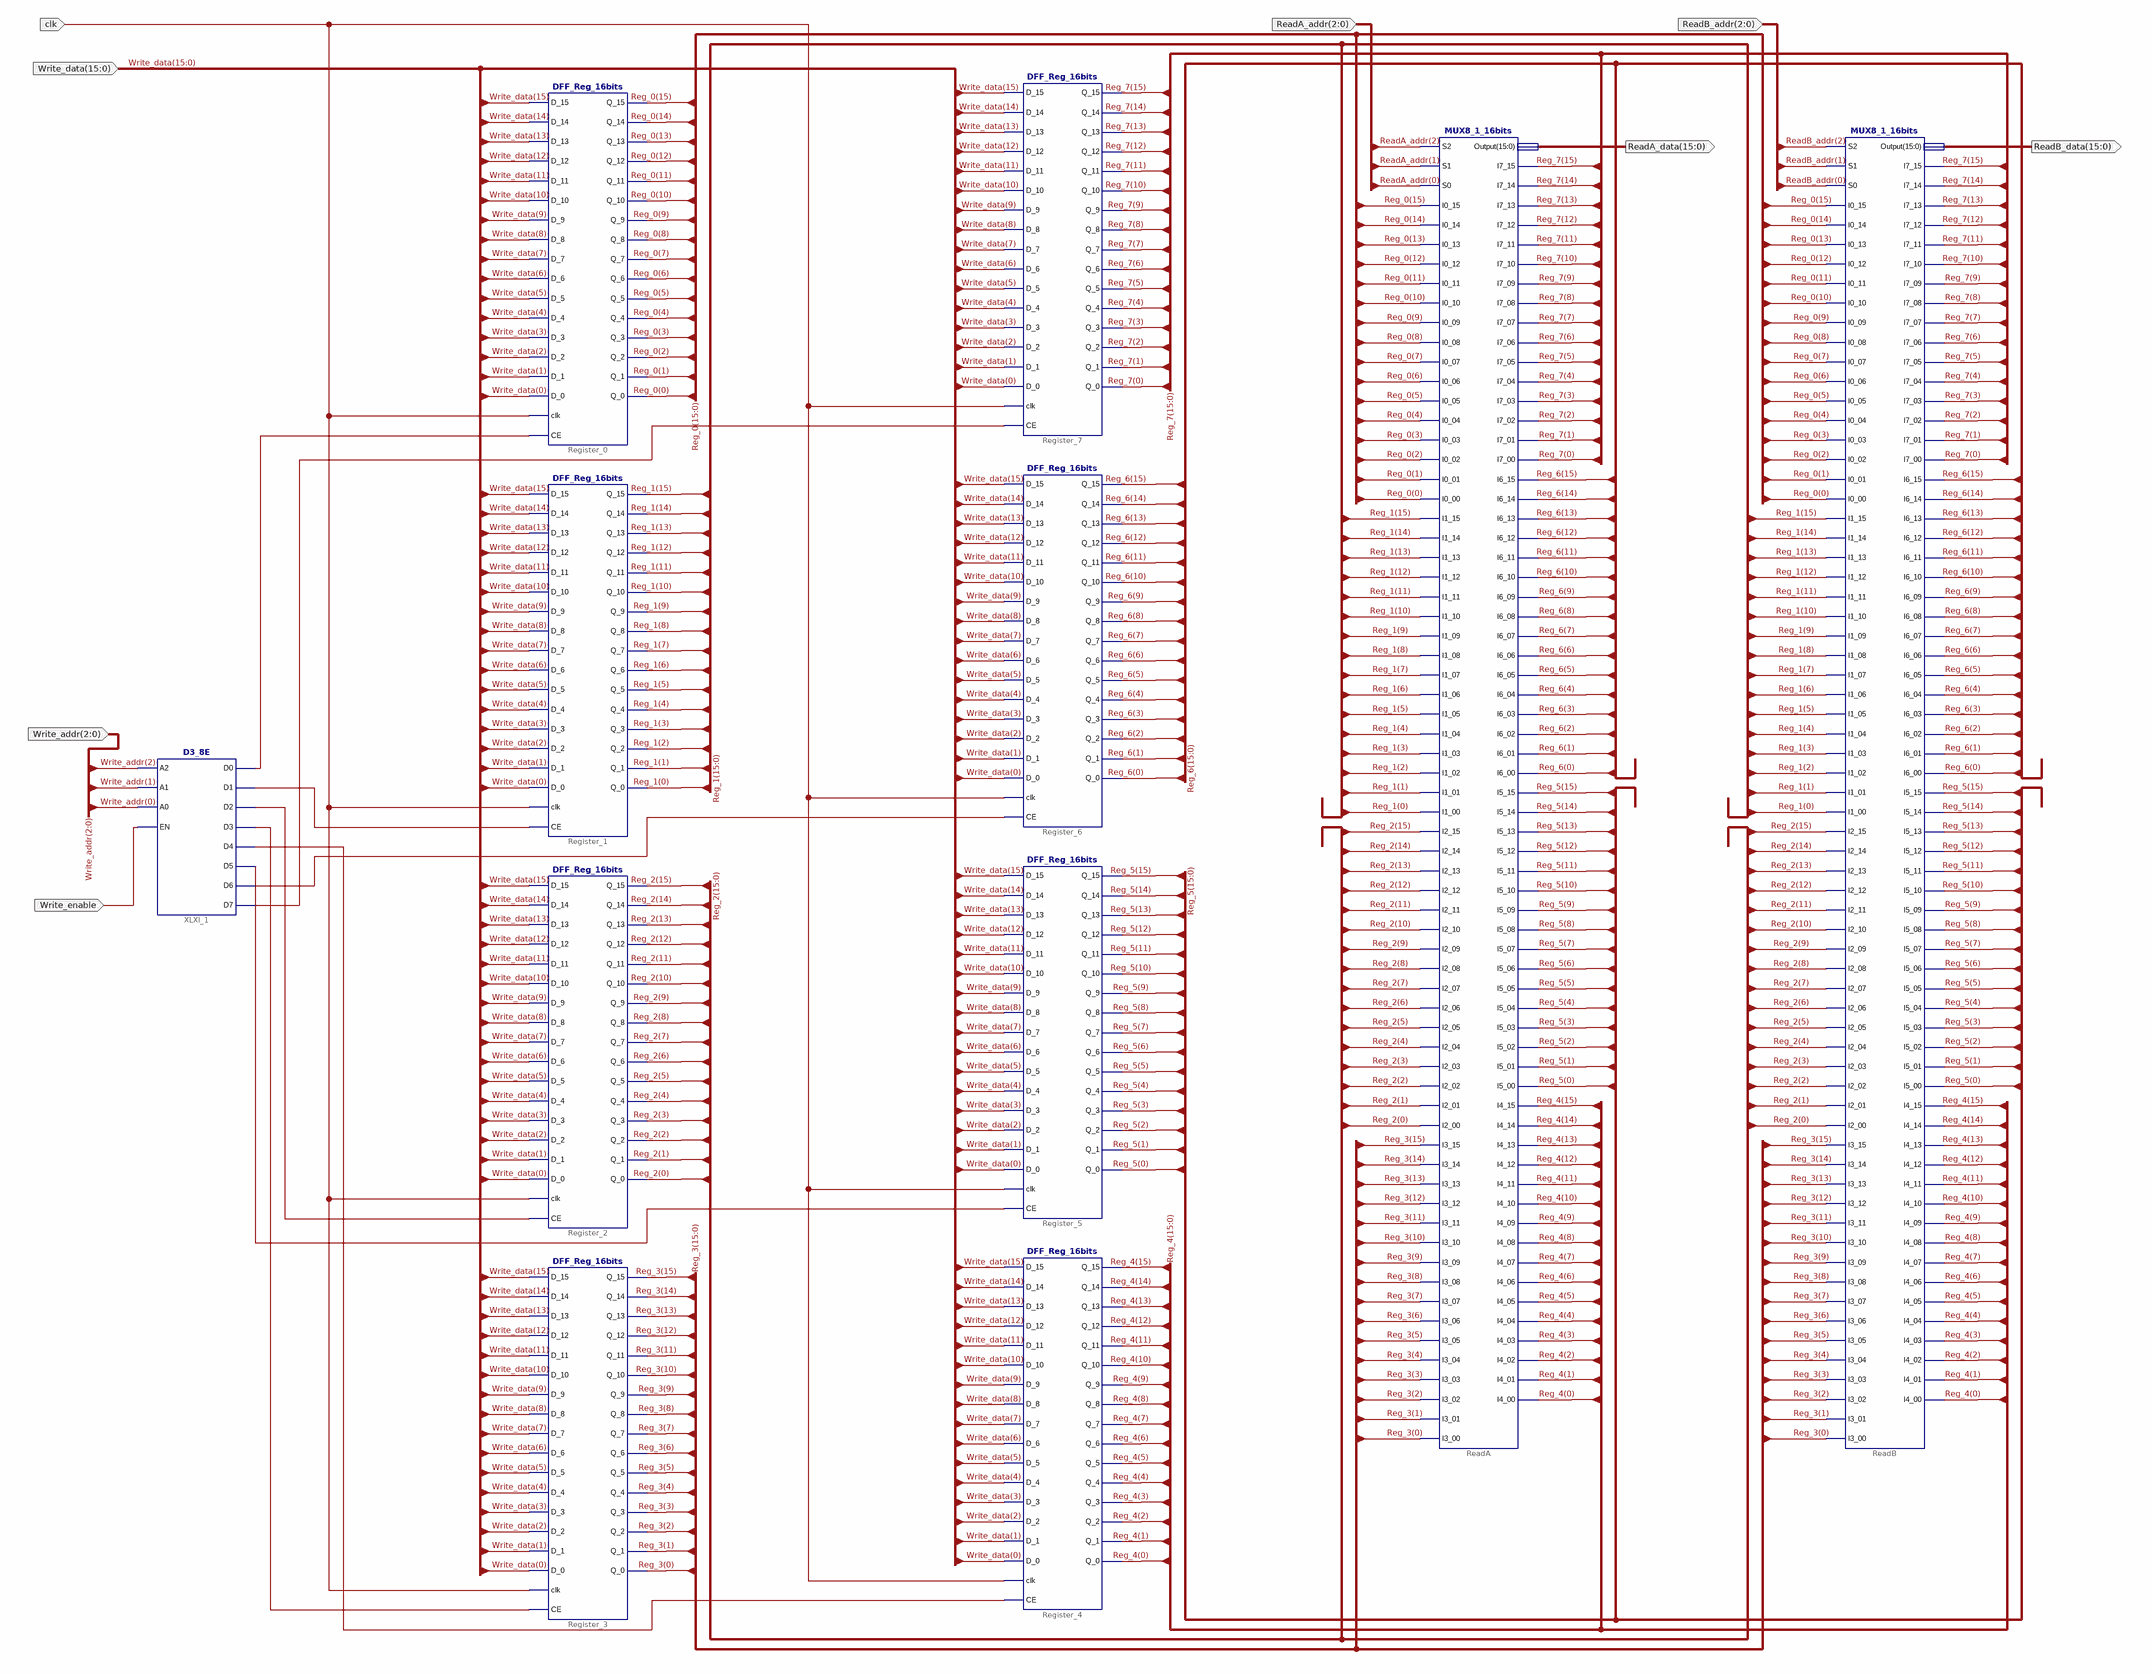
[diagram p0: schematic sheet 1]
// Xilinx ISE schematic Eight_Reg_16bits.sch (virtex6) as structural Verilog: 11 symbols, 8 ports
module Eight_Reg_16bits (
  input  [2:0] Write_addr,
  input  Write_enable,
  input  clk,
  input  [15:0] Write_data,
  input  [2:0] ReadA_addr,
  input  [2:0] ReadB_addr,
  output [15:0] ReadA_data,
  output [15:0] ReadB_data
);

  wire XLXN_65, XLXN_66, XLXN_67, XLXN_68, XLXN_756, XLXN_757, XLXN_758, XLXN_759;
  wire [15:0] Reg_0, Reg_1, Reg_2, Reg_3, Reg_4, Reg_5, Reg_6, Reg_7;

  MUX8_1_16bits ReadB (
    .I4_00(Reg_4[0]), .I4_01(Reg_4[1]), .I4_02(Reg_4[2]), .I4_03(Reg_4[3]), .I4_04(Reg_4[4]),
    .I4_05(Reg_4[5]), .I4_06(Reg_4[6]), .I4_07(Reg_4[7]), .I4_08(Reg_4[8]), .I4_09(Reg_4[9]),
    .I4_10(Reg_4[10]), .I4_11(Reg_4[11]), .I4_12(Reg_4[12]), .I4_13(Reg_4[13]), .I4_14(Reg_4[14]),
    .I4_15(Reg_4[15]), .I5_00(Reg_5[0]), .I5_01(Reg_5[1]), .I5_02(Reg_5[2]), .I5_03(Reg_5[3]),
    .I5_04(Reg_5[4]), .I5_05(Reg_5[5]), .I5_06(Reg_5[6]), .I5_07(Reg_5[7]), .I5_08(Reg_5[8]),
    .I5_09(Reg_5[9]), .I5_10(Reg_5[10]), .I5_11(Reg_5[11]), .I5_12(Reg_5[12]), .I5_13(Reg_5[13]),
    .I5_14(Reg_5[14]), .I5_15(Reg_5[15]), .I6_00(Reg_6[0]), .I6_01(Reg_6[1]), .I6_02(Reg_6[2]),
    .I6_03(Reg_6[3]), .I6_04(Reg_6[4]), .I6_05(Reg_6[5]), .I6_06(Reg_6[6]), .I6_07(Reg_6[7]),
    .I6_08(Reg_6[8]), .I6_09(Reg_6[9]), .I6_10(Reg_6[10]), .I6_11(Reg_6[11]), .I6_12(Reg_6[12]),
    .I6_13(Reg_6[13]), .I6_14(Reg_6[14]), .I6_15(Reg_6[15]), .I7_00(Reg_7[0]), .I7_01(Reg_7[1]),
    .I7_02(Reg_7[2]), .I7_03(Reg_7[3]), .I7_04(Reg_7[4]), .I7_05(Reg_7[5]), .I7_06(Reg_7[6]),
    .I7_07(Reg_7[7]), .I7_08(Reg_7[8]), .I7_09(Reg_7[9]), .I7_10(Reg_7[10]), .I7_11(Reg_7[11]),
    .I7_12(Reg_7[12]), .I7_13(Reg_7[13]), .I7_14(Reg_7[14]), .I7_15(Reg_7[15]), .Output(ReadB_data),
    .S2(ReadB_addr[2]), .S1(ReadB_addr[1]), .S0(ReadB_addr[0]), .I3_15(Reg_3[15]), .I3_14(Reg_3[14]),
    .I3_13(Reg_3[13]), .I3_12(Reg_3[12]), .I3_11(Reg_3[11]), .I3_10(Reg_3[10]), .I3_09(Reg_3[9]),
    .I3_08(Reg_3[8]), .I3_07(Reg_3[7]), .I3_06(Reg_3[6]), .I3_05(Reg_3[5]), .I3_04(Reg_3[4]),
    .I3_03(Reg_3[3]), .I3_02(Reg_3[2]), .I3_01(Reg_3[1]), .I3_00(Reg_3[0]), .I2_15(Reg_2[15]),
    .I2_14(Reg_2[14]), .I2_13(Reg_2[13]), .I2_12(Reg_2[12]), .I2_11(Reg_2[11]), .I2_10(Reg_2[10]),
    .I2_09(Reg_2[9]), .I2_08(Reg_2[8]), .I2_07(Reg_2[7]), .I2_06(Reg_2[6]), .I2_05(Reg_2[5]),
    .I2_04(Reg_2[4]), .I2_03(Reg_2[3]), .I2_02(Reg_2[2]), .I2_01(Reg_2[1]), .I2_00(Reg_2[0]),
    .I1_15(Reg_1[15]), .I1_14(Reg_1[14]), .I1_13(Reg_1[13]), .I1_12(Reg_1[12]), .I1_11(Reg_1[11]),
    .I1_10(Reg_1[10]), .I1_09(Reg_1[9]), .I1_08(Reg_1[8]), .I1_07(Reg_1[7]), .I1_06(Reg_1[6]),
    .I1_05(Reg_1[5]), .I1_04(Reg_1[4]), .I1_03(Reg_1[3]), .I1_02(Reg_1[2]), .I1_01(Reg_1[1]),
    .I1_00(Reg_1[0]), .I0_15(Reg_0[15]), .I0_14(Reg_0[14]), .I0_13(Reg_0[13]), .I0_12(Reg_0[12]),
    .I0_11(Reg_0[11]), .I0_10(Reg_0[10]), .I0_09(Reg_0[9]), .I0_08(Reg_0[8]), .I0_07(Reg_0[7]),
    .I0_06(Reg_0[6]), .I0_05(Reg_0[5]), .I0_04(Reg_0[4]), .I0_03(Reg_0[3]), .I0_02(Reg_0[2]),
    .I0_01(Reg_0[1]), .I0_00(Reg_0[0]));
  DFF_Reg_16bits Register_0 (
    .CE(XLXN_65), .clk(clk), .D_0(Write_data[0]), .D_1(Write_data[1]), .D_10(Write_data[10]),
    .D_11(Write_data[11]), .D_12(Write_data[12]), .D_13(Write_data[13]), .D_14(Write_data[14]),
    .D_15(Write_data[15]), .D_2(Write_data[2]), .D_3(Write_data[3]), .D_4(Write_data[4]),
    .D_5(Write_data[5]), .D_6(Write_data[6]), .D_7(Write_data[7]), .D_8(Write_data[8]), .D_9(Write_data[9]),
    .Q_0(Reg_0[0]), .Q_1(Reg_0[1]), .Q_10(Reg_0[10]), .Q_11(Reg_0[11]), .Q_12(Reg_0[12]), .Q_13(Reg_0[13]),
    .Q_14(Reg_0[14]), .Q_15(Reg_0[15]), .Q_2(Reg_0[2]), .Q_3(Reg_0[3]), .Q_4(Reg_0[4]), .Q_5(Reg_0[5]),
    .Q_6(Reg_0[6]), .Q_7(Reg_0[7]), .Q_8(Reg_0[8]), .Q_9(Reg_0[9]));
  DFF_Reg_16bits Register_1 (
    .CE(XLXN_66), .clk(clk), .D_0(Write_data[0]), .D_1(Write_data[1]), .D_10(Write_data[10]),
    .D_11(Write_data[11]), .D_12(Write_data[12]), .D_13(Write_data[13]), .D_14(Write_data[14]),
    .D_15(Write_data[15]), .D_2(Write_data[2]), .D_3(Write_data[3]), .D_4(Write_data[4]),
    .D_5(Write_data[5]), .D_6(Write_data[6]), .D_7(Write_data[7]), .D_8(Write_data[8]), .D_9(Write_data[9]),
    .Q_0(Reg_1[0]), .Q_1(Reg_1[1]), .Q_10(Reg_1[10]), .Q_11(Reg_1[11]), .Q_12(Reg_1[12]), .Q_13(Reg_1[13]),
    .Q_14(Reg_1[14]), .Q_15(Reg_1[15]), .Q_2(Reg_1[2]), .Q_3(Reg_1[3]), .Q_4(Reg_1[4]), .Q_5(Reg_1[5]),
    .Q_6(Reg_1[6]), .Q_7(Reg_1[7]), .Q_8(Reg_1[8]), .Q_9(Reg_1[9]));
  DFF_Reg_16bits Register_2 (
    .CE(XLXN_67), .clk(clk), .D_0(Write_data[0]), .D_1(Write_data[1]), .D_10(Write_data[10]),
    .D_11(Write_data[11]), .D_12(Write_data[12]), .D_13(Write_data[13]), .D_14(Write_data[14]),
    .D_15(Write_data[15]), .D_2(Write_data[2]), .D_3(Write_data[3]), .D_4(Write_data[4]),
    .D_5(Write_data[5]), .D_6(Write_data[6]), .D_7(Write_data[7]), .D_8(Write_data[8]), .D_9(Write_data[9]),
    .Q_0(Reg_2[0]), .Q_1(Reg_2[1]), .Q_10(Reg_2[10]), .Q_11(Reg_2[11]), .Q_12(Reg_2[12]), .Q_13(Reg_2[13]),
    .Q_14(Reg_2[14]), .Q_15(Reg_2[15]), .Q_2(Reg_2[2]), .Q_3(Reg_2[3]), .Q_4(Reg_2[4]), .Q_5(Reg_2[5]),
    .Q_6(Reg_2[6]), .Q_7(Reg_2[7]), .Q_8(Reg_2[8]), .Q_9(Reg_2[9]));
  DFF_Reg_16bits Register_3 (
    .CE(XLXN_68), .clk(clk), .D_0(Write_data[0]), .D_1(Write_data[1]), .D_10(Write_data[10]),
    .D_11(Write_data[11]), .D_12(Write_data[12]), .D_13(Write_data[13]), .D_14(Write_data[14]),
    .D_15(Write_data[15]), .D_2(Write_data[2]), .D_3(Write_data[3]), .D_4(Write_data[4]),
    .D_5(Write_data[5]), .D_6(Write_data[6]), .D_7(Write_data[7]), .D_8(Write_data[8]), .D_9(Write_data[9]),
    .Q_0(Reg_3[0]), .Q_1(Reg_3[1]), .Q_10(Reg_3[10]), .Q_11(Reg_3[11]), .Q_12(Reg_3[12]), .Q_13(Reg_3[13]),
    .Q_14(Reg_3[14]), .Q_15(Reg_3[15]), .Q_2(Reg_3[2]), .Q_3(Reg_3[3]), .Q_4(Reg_3[4]), .Q_5(Reg_3[5]),
    .Q_6(Reg_3[6]), .Q_7(Reg_3[7]), .Q_8(Reg_3[8]), .Q_9(Reg_3[9]));
  DFF_Reg_16bits Register_7 (
    .CE(XLXN_756), .clk(clk), .D_0(Write_data[0]), .D_1(Write_data[1]), .D_10(Write_data[10]),
    .D_11(Write_data[11]), .D_12(Write_data[12]), .D_13(Write_data[13]), .D_14(Write_data[14]),
    .D_15(Write_data[15]), .D_2(Write_data[2]), .D_3(Write_data[3]), .D_4(Write_data[4]),
    .D_5(Write_data[5]), .D_6(Write_data[6]), .D_7(Write_data[7]), .D_8(Write_data[8]), .D_9(Write_data[9]),
    .Q_0(Reg_7[0]), .Q_1(Reg_7[1]), .Q_10(Reg_7[10]), .Q_11(Reg_7[11]), .Q_12(Reg_7[12]), .Q_13(Reg_7[13]),
    .Q_14(Reg_7[14]), .Q_15(Reg_7[15]), .Q_2(Reg_7[2]), .Q_3(Reg_7[3]), .Q_4(Reg_7[4]), .Q_5(Reg_7[5]),
    .Q_6(Reg_7[6]), .Q_7(Reg_7[7]), .Q_8(Reg_7[8]), .Q_9(Reg_7[9]));
  DFF_Reg_16bits Register_6 (
    .CE(XLXN_757), .clk(clk), .D_0(Write_data[0]), .D_1(Write_data[1]), .D_10(Write_data[10]),
    .D_11(Write_data[11]), .D_12(Write_data[12]), .D_13(Write_data[13]), .D_14(Write_data[14]),
    .D_15(Write_data[15]), .D_2(Write_data[2]), .D_3(Write_data[3]), .D_4(Write_data[4]),
    .D_5(Write_data[5]), .D_6(Write_data[6]), .D_7(Write_data[7]), .D_8(Write_data[8]), .D_9(Write_data[9]),
    .Q_0(Reg_6[0]), .Q_1(Reg_6[1]), .Q_10(Reg_6[10]), .Q_11(Reg_6[11]), .Q_12(Reg_6[12]), .Q_13(Reg_6[13]),
    .Q_14(Reg_6[14]), .Q_15(Reg_6[15]), .Q_2(Reg_6[2]), .Q_3(Reg_6[3]), .Q_4(Reg_6[4]), .Q_5(Reg_6[5]),
    .Q_6(Reg_6[6]), .Q_7(Reg_6[7]), .Q_8(Reg_6[8]), .Q_9(Reg_6[9]));
  DFF_Reg_16bits Register_5 (
    .CE(XLXN_758), .clk(clk), .D_0(Write_data[0]), .D_1(Write_data[1]), .D_10(Write_data[10]),
    .D_11(Write_data[11]), .D_12(Write_data[12]), .D_13(Write_data[13]), .D_14(Write_data[14]),
    .D_15(Write_data[15]), .D_2(Write_data[2]), .D_3(Write_data[3]), .D_4(Write_data[4]),
    .D_5(Write_data[5]), .D_6(Write_data[6]), .D_7(Write_data[7]), .D_8(Write_data[8]), .D_9(Write_data[9]),
    .Q_0(Reg_5[0]), .Q_1(Reg_5[1]), .Q_10(Reg_5[10]), .Q_11(Reg_5[11]), .Q_12(Reg_5[12]), .Q_13(Reg_5[13]),
    .Q_14(Reg_5[14]), .Q_15(Reg_5[15]), .Q_2(Reg_5[2]), .Q_3(Reg_5[3]), .Q_4(Reg_5[4]), .Q_5(Reg_5[5]),
    .Q_6(Reg_5[6]), .Q_7(Reg_5[7]), .Q_8(Reg_5[8]), .Q_9(Reg_5[9]));
  DFF_Reg_16bits Register_4 (
    .CE(XLXN_759), .clk(clk), .D_0(Write_data[0]), .D_1(Write_data[1]), .D_10(Write_data[10]),
    .D_11(Write_data[11]), .D_12(Write_data[12]), .D_13(Write_data[13]), .D_14(Write_data[14]),
    .D_15(Write_data[15]), .D_2(Write_data[2]), .D_3(Write_data[3]), .D_4(Write_data[4]),
    .D_5(Write_data[5]), .D_6(Write_data[6]), .D_7(Write_data[7]), .D_8(Write_data[8]), .D_9(Write_data[9]),
    .Q_0(Reg_4[0]), .Q_1(Reg_4[1]), .Q_10(Reg_4[10]), .Q_11(Reg_4[11]), .Q_12(Reg_4[12]), .Q_13(Reg_4[13]),
    .Q_14(Reg_4[14]), .Q_15(Reg_4[15]), .Q_2(Reg_4[2]), .Q_3(Reg_4[3]), .Q_4(Reg_4[4]), .Q_5(Reg_4[5]),
    .Q_6(Reg_4[6]), .Q_7(Reg_4[7]), .Q_8(Reg_4[8]), .Q_9(Reg_4[9]));
  MUX8_1_16bits ReadA (
    .I4_00(Reg_4[0]), .I4_01(Reg_4[1]), .I4_02(Reg_4[2]), .I4_03(Reg_4[3]), .I4_04(Reg_4[4]),
    .I4_05(Reg_4[5]), .I4_06(Reg_4[6]), .I4_07(Reg_4[7]), .I4_08(Reg_4[8]), .I4_09(Reg_4[9]),
    .I4_10(Reg_4[10]), .I4_11(Reg_4[11]), .I4_12(Reg_4[12]), .I4_13(Reg_4[13]), .I4_14(Reg_4[14]),
    .I4_15(Reg_4[15]), .I5_00(Reg_5[0]), .I5_01(Reg_5[1]), .I5_02(Reg_5[2]), .I5_03(Reg_5[3]),
    .I5_04(Reg_5[4]), .I5_05(Reg_5[5]), .I5_06(Reg_5[6]), .I5_07(Reg_5[7]), .I5_08(Reg_5[8]),
    .I5_09(Reg_5[9]), .I5_10(Reg_5[10]), .I5_11(Reg_5[11]), .I5_12(Reg_5[12]), .I5_13(Reg_5[13]),
    .I5_14(Reg_5[14]), .I5_15(Reg_5[15]), .I6_00(Reg_6[0]), .I6_01(Reg_6[1]), .I6_02(Reg_6[2]),
    .I6_03(Reg_6[3]), .I6_04(Reg_6[4]), .I6_05(Reg_6[5]), .I6_06(Reg_6[6]), .I6_07(Reg_6[7]),
    .I6_08(Reg_6[8]), .I6_09(Reg_6[9]), .I6_10(Reg_6[10]), .I6_11(Reg_6[11]), .I6_12(Reg_6[12]),
    .I6_13(Reg_6[13]), .I6_14(Reg_6[14]), .I6_15(Reg_6[15]), .I7_00(Reg_7[0]), .I7_01(Reg_7[1]),
    .I7_02(Reg_7[2]), .I7_03(Reg_7[3]), .I7_04(Reg_7[4]), .I7_05(Reg_7[5]), .I7_06(Reg_7[6]),
    .I7_07(Reg_7[7]), .I7_08(Reg_7[8]), .I7_09(Reg_7[9]), .I7_10(Reg_7[10]), .I7_11(Reg_7[11]),
    .I7_12(Reg_7[12]), .I7_13(Reg_7[13]), .I7_14(Reg_7[14]), .I7_15(Reg_7[15]), .Output(ReadA_data),
    .S2(ReadA_addr[2]), .S1(ReadA_addr[1]), .S0(ReadA_addr[0]), .I3_15(Reg_3[15]), .I3_14(Reg_3[14]),
    .I3_13(Reg_3[13]), .I3_12(Reg_3[12]), .I3_11(Reg_3[11]), .I3_10(Reg_3[10]), .I3_09(Reg_3[9]),
    .I3_08(Reg_3[8]), .I3_07(Reg_3[7]), .I3_06(Reg_3[6]), .I3_05(Reg_3[5]), .I3_04(Reg_3[4]),
    .I3_03(Reg_3[3]), .I3_02(Reg_3[2]), .I3_01(Reg_3[1]), .I3_00(Reg_3[0]), .I2_15(Reg_2[15]),
    .I2_14(Reg_2[14]), .I2_13(Reg_2[13]), .I2_12(Reg_2[12]), .I2_11(Reg_2[11]), .I2_10(Reg_2[10]),
    .I2_09(Reg_2[9]), .I2_08(Reg_2[8]), .I2_07(Reg_2[7]), .I2_06(Reg_2[6]), .I2_05(Reg_2[5]),
    .I2_04(Reg_2[4]), .I2_03(Reg_2[3]), .I2_02(Reg_2[2]), .I2_01(Reg_2[1]), .I2_00(Reg_2[0]),
    .I1_15(Reg_1[15]), .I1_14(Reg_1[14]), .I1_13(Reg_1[13]), .I1_12(Reg_1[12]), .I1_11(Reg_1[11]),
    .I1_10(Reg_1[10]), .I1_09(Reg_1[9]), .I1_08(Reg_1[8]), .I1_07(Reg_1[7]), .I1_06(Reg_1[6]),
    .I1_05(Reg_1[5]), .I1_04(Reg_1[4]), .I1_03(Reg_1[3]), .I1_02(Reg_1[2]), .I1_01(Reg_1[1]),
    .I1_00(Reg_1[0]), .I0_15(Reg_0[15]), .I0_14(Reg_0[14]), .I0_13(Reg_0[13]), .I0_12(Reg_0[12]),
    .I0_11(Reg_0[11]), .I0_10(Reg_0[10]), .I0_09(Reg_0[9]), .I0_08(Reg_0[8]), .I0_07(Reg_0[7]),
    .I0_06(Reg_0[6]), .I0_05(Reg_0[5]), .I0_04(Reg_0[4]), .I0_03(Reg_0[3]), .I0_02(Reg_0[2]),
    .I0_01(Reg_0[1]), .I0_00(Reg_0[0]));
  D3_8E XLXI_1 (
    .A0(Write_addr[0]), .A1(Write_addr[1]), .A2(Write_addr[2]), .D0(XLXN_65), .D1(XLXN_66), .D2(XLXN_67),
    .D3(XLXN_68), .D4(XLXN_759), .D5(XLXN_758), .D6(XLXN_757), .D7(XLXN_756), .EN(Write_enable));
endmodule
